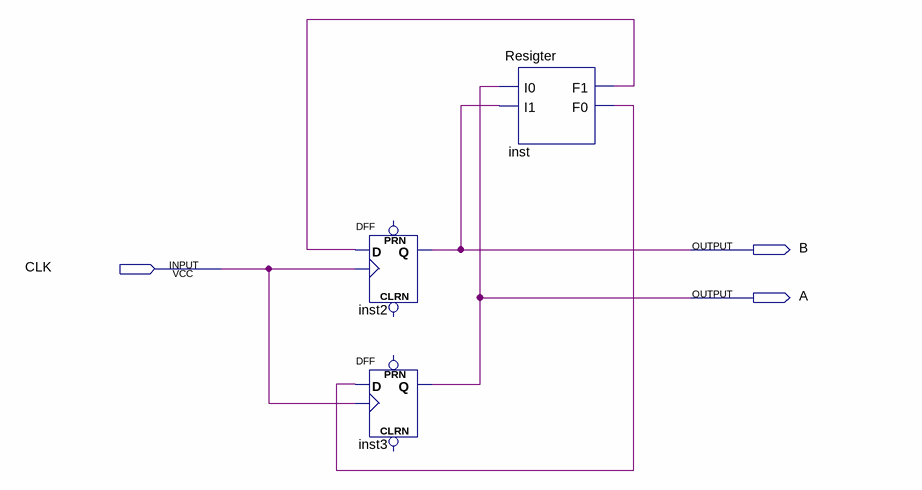
[diagram p0: schematic sheet]
// Quartus schematic BodemIncrement.bdf as structural Verilog: 3 symbols, 3 pins
module BodemIncrement (
  input  CLK,
  output B,
  output A
);

  wire inst_f0, inst_f1;

  DFF inst2 (.CLK(CLK), .D(inst_f1), .Q(B));  // open: CLRN, PRN
  DFF inst3 (.CLK(CLK), .D(inst_f0), .Q(A));  // open: CLRN, PRN
  Resigter inst (.I0(A), .I1(B), .F1(inst_f1), .F0(inst_f0));
endmodule
